# Altium project controler.PrjPcb
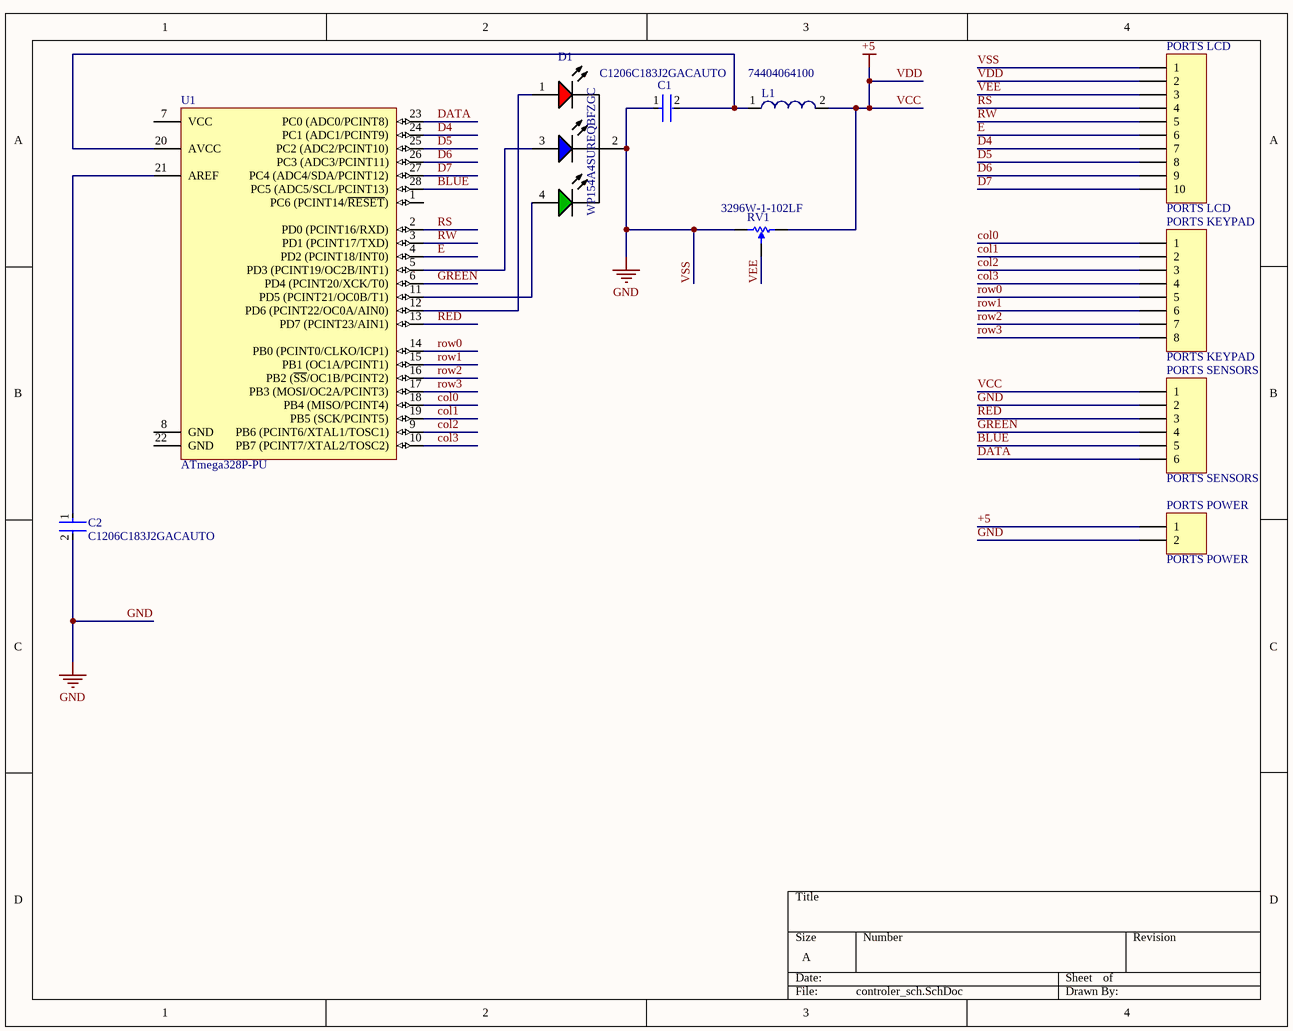
[diagram p0: controler_sch.SchDoc]
1 sheet, 10 parts. Net scope: global (net labels, ports and power ports of the same name join across sheets).
Board file: controler_pcb.PcbDoc

## Sheet controler_sch.SchDoc
size A

### Parts
C1  C1206C183J2GACAUTO  [FP-C1206C-EB-MFG]
C2  C1206C183J2GACAUTO  [FP-C1206C-EB-MFG]
D1  WP154A4SUREQBFZGC  [KING-WP154A4SUREQBFZGC_V]
L1  74404064100  [WE-LQS 6045]
PORTS_KEYPAD  PORTS KEYPAD  [HDR1X8]
PORTS_LCD  PORTS LCD  [HDR1X10]
PORTS_POWER  PORTS POWER  [HDR1X2]
PORTS_SENSORS  PORTS SENSORS  [HDR1X6]
RV1  3296W-1-102LF  [BOUR-3296W-1-3]
U1  ATmega328P-PU  [28P3]

### Nets
+5: L1.2 PORTS_LCD.2 PORTS_POWER.1 PORTS_SENSORS.1 RV1.2(B)  [also labelled VCC, VDD]
GND: C1.1 C2.2 D1.2(CATHODE) PORTS_LCD.1 PORTS_POWER.2 PORTS_SENSORS.2 RV1.1(A)  [also labelled VSS]
BLUE: PORTS_SENSORS.5 U1.28(PC5_(ADC5/SCL/PCINT13))
col0: PORTS_KEYPAD.1 U1.18(PB4_(MISO/PCINT4))
col1: PORTS_KEYPAD.2 U1.19(PB5_(SCK/PCINT5))
col2: PORTS_KEYPAD.3 U1.9(PB6_(PCINT6/XTAL1/TOSC1))
col3: PORTS_KEYPAD.4 U1.10(PB7_(PCINT7/XTAL2/TOSC2))
D4: PORTS_LCD.7 U1.24(PC1_(ADC1/PCINT9))
D5: PORTS_LCD.8 U1.25(PC2_(ADC2/PCINT10))
D6: PORTS_LCD.9 U1.26(PC3_(ADC3/PCINT11))
D7: PORTS_LCD.10 U1.27(PC4_(ADC4/SDA/PCINT12))
DATA: PORTS_SENSORS.6 U1.23(PC0_(ADC0/PCINT8))
E: PORTS_LCD.6 U1.4(PD2_(PCINT18/INT0))
GREEN: PORTS_SENSORS.4 U1.6(PD4_(PCINT20/XCK/T0))
RED: PORTS_SENSORS.3 U1.13(PD7_(PCINT23/AIN1))
row0: PORTS_KEYPAD.5 U1.14(PB0_(PCINT0/CLKO/ICP1))
row1: PORTS_KEYPAD.6 U1.15(PB1_(OC1A/PCINT1))
row2: PORTS_KEYPAD.7 U1.16(PB2_(~{SS}/OC1B/PCINT2))
row3: PORTS_KEYPAD.8 U1.17(PB3_(MOSI/OC2A/PCINT3))
RS: PORTS_LCD.4 U1.2(PD0_(PCINT16/RXD))
RW: PORTS_LCD.5 U1.3(PD1_(PCINT17/TXD))
VEE: PORTS_LCD.3 RV1.3(TAP)
NetC1_2: C1.2 L1.1 U1.20(AVCC)
NetC2_1: C2.1 U1.21(AREF)
NetD1_1: D1.1(RED) U1.12(PD6_(PCINT22/OC0A/AIN0))
NetD1_3: D1.3(BLUE) U1.5(PD3_(PCINT19/OC2B/INT1))
NetD1_4: D1.4(GREEN) U1.11(PD5_(PCINT21/OC0B/T1))

Not connected (* = marked no-connect by the designer): U1 1(PC6_(PCINT14/~{RESET})) 7(VCC) 8(GND) 22(GND)

### Library data of the parts
C1 C2 = CMP-03020-017738-1: CAP CER 0.018UF 200V NP0 1206; Manufacturer: KEMET; Temperature Coefficient: 15%; Temperature Characteristic: C0G; Material: Ceramic; Capacitance: 18,000 pF; Value: 18,000 pF; Tolerance: 0.05; Automotive Grade: Grade 0; Height: 0.88mm; Device Class L1: Passive Components; Digikey Description: CAP CER 0.018UF 200V NP0 1206; Lead Free: Yes; Category: Cap; Manufacturer Part Number: C1206C183J2GACAUTO; Octopart: https://octopart.com/c1206c183j2gacauto-kemet-46732638; Temperature: -55°C to +150°C; Device Class L2: Capacitors; Temperature Range Low: -55°C; ComponentLink2Description: Datasheet; RoHS: TRUE; Voltage Rating: 200 V; Ipc Land Pattern Name: CAPC320160X78; Temperature Range High: +150°C; Device Class L3: Ceramic Capacitors; Mouser Description: Multilayer Ceramic Capacitors MLCC - SMD/SMT 200volts 18000pF 5% AUTO; Automotive: Yes; ComponentLink2URL: https://content.kemet.com/datasheets/KEM_C1007_X8R_ULTRA_150C_SMD.pdf; Package: C1206C-EB
D1 = CMP-2000-07415-1: Full Color LED Lamp, Dominant Wavelength RGB 630 / 525 / 465 nm, -40 to 85 degC, 4-Pin THD, RoHS; Manufacturer: Kingbright; Viewing Angle: 50°; Wavelength - Dominant: 630nm,525nm,465nm; Online Catalog: 5mm,T-13/4(RGB)RoundwithDomedTopLEDLamp; Millicandela Rating: 1300mcdRed,1700mcdGreen,900mcdBlue; Other Names: 754-1615 / WP154A4SUREQBFZGC-ND; Current - Test: 20mA; Wavelength - Peak: 645nm,515nm,460nm; Color: Red,Green,Blue(RGB); Voltage - Forward (Vf) (Typ): 1.9VRed,3.3VGreen,3.3VBlue; Lens Type: Clear; 3D Model: WP154A4SUREQBFZGW.sldprt / WP154A4SUREQBFZGW.pro / WP154A4SUREQBFZGW.igs / WP154A4SUREQBFZGW.stp; Lens Style/Size: RoundwithDomedTop,5mm,T-13/4; Packaging: Bulk; Datasheet URL: https://www.kingbrightusa.com/images/catalog/spec/WP154A4SUREQBFZGC.pdf; Family: LEDIndication-Discrete; Datasheet Version: Rev. 5A, 08/2014; Category: Optoelectronics; Manufacturer URL: http://www.kingbright.com/; Height: 8.60mm; Mounting Type: ThroughHole; Package Reference: WP154A4SUREQBFZGC; Mounting Technology: ThroughHole; Package Description: 4-Pin Through Hole LED, Dia 5.9 mm, Pitch 1.27 mm; Standard Package: 500; Package / Case: Radial-4Leads
L1 = CMP-1354-00072-1: WE-LQS SMD Power Inductor, L=10.0 µH; Manufacturer: Wuerth Elektronik; Inductance: 10.0 ÂµH; ComponentLink2URL: http://katalog.we-online.de/pbs/datasheet/74404064100.pdf; ComponentLink1Description: Manufacturer URL; PartNumber: 74404064100; ComponentLink2Description: Datasheet; ComponentLink1URL: http://www.we-online.com; PackageReference: WE-LQS 6045
PORTS_KEYPAD = Header 8: Header, 8-Pin; LatestRevisionDate: 17-Jul-2002; LatestRevisionNote: Re-released for DXP Platform.; Publisher: Altium Limited
PORTS_LCD = Header 10: Header, 10-Pin; LatestRevisionDate: 17-Jul-2002; LatestRevisionNote: Re-released for DXP Platform.; Publisher: Altium Limited
PORTS_POWER = Header 2: Header, 2-Pin; LatestRevisionDate: 17-Jul-2002; LatestRevisionNote: Re-released for DXP Platform.; Publisher: Altium Limited
PORTS_SENSORS = Header 6: Header, 6-Pin; LatestRevisionDate: 17-Jul-2002; LatestRevisionNote: Re-released for DXP Platform.; Publisher: Altium Limited
RV1 = CMP-1747-00002-1: Square Trimpot(R) Trimming Potentiometer, 1000 Ohm, -55 to 125 degC, 3-Pin THD, RoHS, Tube; Case\Package: 0603; Tolerance: 1%; Power Rating: 100 mW; Voltage Rating: 75 V; Resistance: 4.7 kohm; ComponentLink2URL: http://www.bourns.com/docs/Product-Datasheets/3296.pdf; Packaging: Tape and Reel; REACH SVHC: Yes; ComponentLink1URL: http://www.bourns.com/; Case Code (Metric): 1608; Width: 0.8 mm; ComponentLink1Description: Manufacturer URL; DatasheetVersion: May-16; Max Operating Temperature: 155 degC; PackageReference: 3296W-1-3; PackageDescription: 3-Pin Through Hole Device, Body 9.53 x 4.83 mm, Pitch 2.54 mm; Weight: 7.1E-05 oz; ComponentLink2Description: Datasheet; RoHSCompliant: true; Min Operating Temperature: -55 degC; Radiation Hardening: No; Case Code (Imperial): 0603; Length: 1.6 mm; Package Quantity: 5000; Pins: 2; Mount: Surface Mount; Height: 0.45 mm
U1 = CMP-0095-00013-2: 8-bit AVR Microcontroller, 32KB Flash, 1KB EEPROM, 2KB SRAM, 28-pin PDIP, Industrial Grade (-40°C to 85°C); RevisionNote: DatasheetVersion updated. URLs added.; PackageVersion: revB, Sep-2001; PackageDescription: 28-lead (0.300"/7.62mm Wide) Plastic Dual Inline Package (PDIP); DatasheetVersion: revD, May-2011; ComponentLink1Description: Manufacturer URL; ComponentLink1URL: http://www.atmel.com/; PackageReference: 28P3; ComponentLink2Description: ATmega48A/48PA/88A/88PA/168A/168PA/328/328P Datasheet; ComponentLink3URL: http://www.atmel.com/dyn/resources/prod_documents/8271S.pdf; ComponentLink2URL: http://www.atmel.com/dyn/resources/prod_documents/8271.pdf; ComponentLink3Description: ATmega48A/48PA/88A/88PA/168A/168PA/328/328P Summary